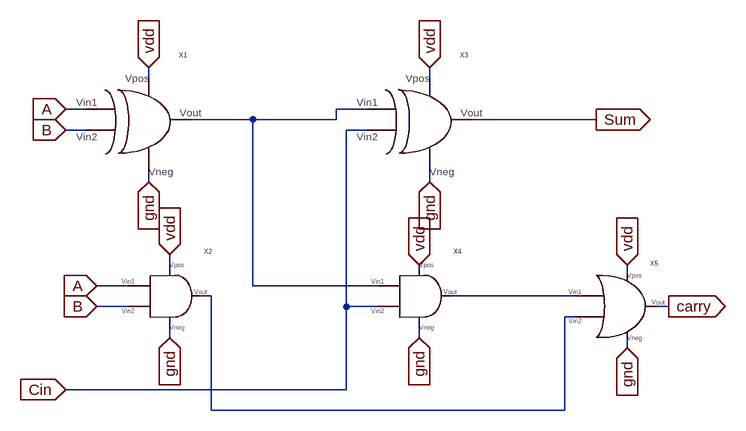
[diagram p0: schematic fa.asc]
fa.asc, the LTspice schematic file:
Version 4
SHEET 1 880 680
WIRE -368 -320 -368 -336
WIRE 64 -320 64 -336
WIRE -464 -272 -496 -272
WIRE -32 -272 -80 -272
WIRE -208 -256 -304 -256
WIRE -80 -256 -80 -272
WIRE -80 -256 -208 -256
WIRE 320 -256 128 -256
WIRE -464 -240 -496 -240
WIRE -32 -240 -64 -240
WIRE -368 -160 -368 -176
WIRE 64 -160 64 -176
WIRE -336 -32 -336 -48
WIRE 368 -16 368 -32
WIRE -400 0 -448 0
WIRE -208 0 -208 -256
WIRE -16 0 -208 0
WIRE -272 16 -288 16
WIRE 288 16 96 16
WIRE -400 32 -448 32
WIRE -64 32 -64 -240
WIRE -16 32 -64 32
WIRE 432 32 416 32
WIRE 288 48 272 48
WIRE -336 80 -336 64
WIRE 48 80 48 64
WIRE 368 96 368 80
WIRE -64 160 -64 32
WIRE -64 160 -496 160
WIRE -272 192 -272 16
WIRE 272 192 272 48
WIRE 272 192 -272 192
FLAG -368 -336 vdd
IOPIN -368 -336 In
FLAG -336 -48 vdd
IOPIN -336 -48 In
FLAG 64 -336 vdd
IOPIN 64 -336 In
FLAG 48 -32 vdd
IOPIN 48 -32 In
FLAG 320 -256 Sum
IOPIN 320 -256 Out
FLAG 368 -32 vdd
IOPIN 368 -32 In
FLAG 432 32 carry
IOPIN 432 32 Out
FLAG 64 -160 gnd
IOPIN 64 -160 In
FLAG 48 80 gnd
IOPIN 48 80 In
FLAG -336 80 gnd
IOPIN -336 80 In
FLAG -368 -160 gnd
IOPIN -368 -160 In
FLAG 368 96 gnd
IOPIN 368 96 In
FLAG -496 -272 A
IOPIN -496 -272 In
FLAG -448 0 A
IOPIN -448 0 In
FLAG -448 32 B
IOPIN -448 32 In
FLAG -496 -240 B
IOPIN -496 -240 In
FLAG -496 160 Cin
IOPIN -496 160 In
SYMBOL xor -320 -272 R0
SYMATTR InstName X1
SYMBOL and -304 16 R0
SYMATTR InstName X2
SYMBOL xor 112 -272 R0
SYMATTR InstName X3
SYMBOL and 80 16 R0
SYMATTR InstName X4
SYMBOL or 112 32 R0
SYMATTR InstName X5

The netlist it stands for:
* fa.asc
XX1 A B vdd gnd N001 xor  ; pins A B vdd gnd Y
XX2 vdd A B gnd N002 and  ; pins vdd A B gnd Y
XX3 N001 Cin vdd gnd Sum xor  ; pins A B vdd gnd Y
XX4 vdd N001 Cin gnd N003 and  ; pins vdd A B gnd Y
XX5 vdd N003 N002 gnd carry or  ; pins vdd A B gnd Y
.backanno
.end